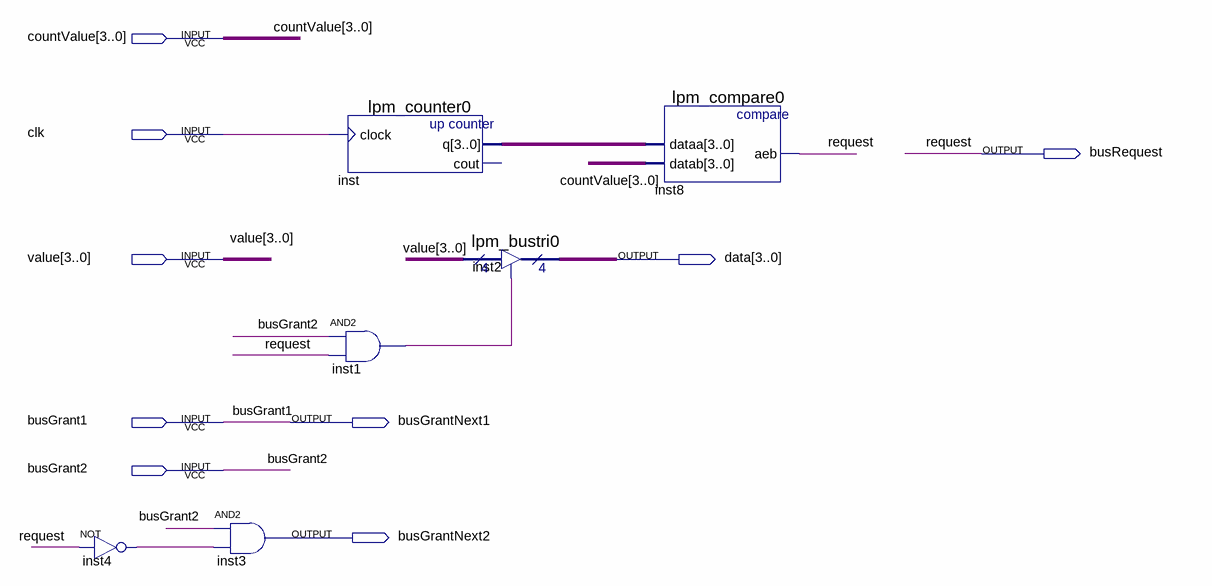
[diagram p0: schematic sheet]
// Quartus schematic DeviceLevel2.bdf as structural Verilog: 6 symbols, 9 pins
module DeviceLevel2 (
  input  [3:0] countValue,
  input  clk,
  input  [3:0] value,
  input  busGrant1,
  input  busGrant2,
  output busRequest,
  output [3:0] data,
  output busGrantNext1,
  output busGrantNext2
);

  wire inst1_out, inst4_out;
  wire [3:0] inst_q;

  not inst4 (inst4_out, busRequest);
  and inst3 (busGrantNext2, busGrant2, inst4_out);
  lpm_counter0 inst (.clock(clk), .q(inst_q));  // open: cout
  and inst1 (inst1_out, busGrant2, busRequest);
  lpm_bustri0 inst2 (.enabledt(inst1_out), .data(value), .tridata(data));
  lpm_compare0 inst8 (.dataa(inst_q), .datab(countValue), .aeb(busRequest));

  assign busGrantNext1 = busGrant1;

  // Other names for the same wires on the sheet: request = busRequest
endmodule
